# Altium project pressure_stm.PrjPcb
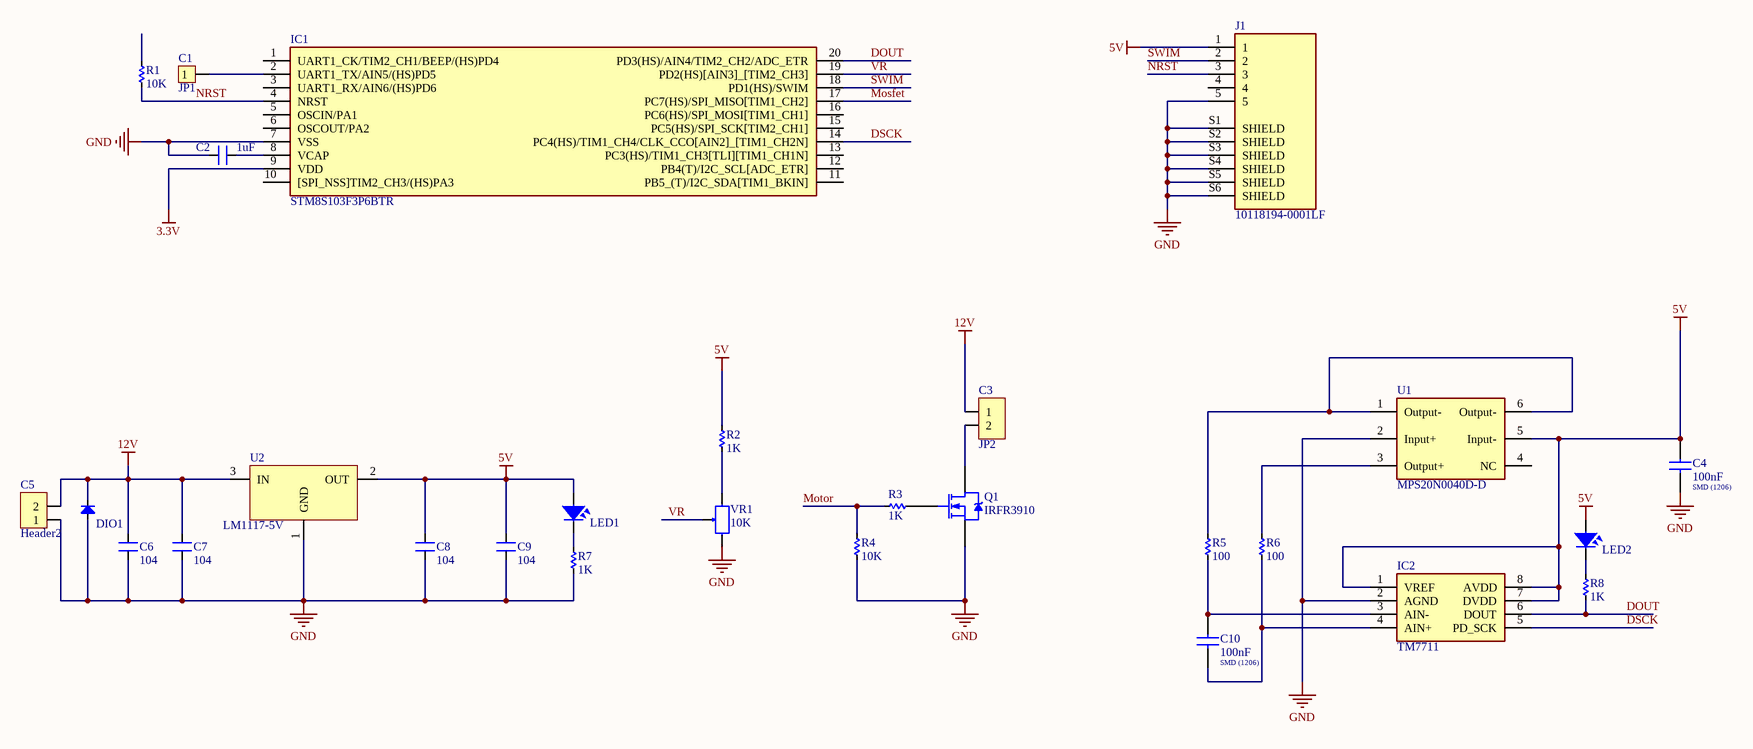
[diagram p0: pressure_stm_schematic.SchDoc]
1 sheet, 28 parts. Net scope: global (net labels, ports and power ports of the same name join across sheets).
Board file: pressure_stm_pcb.PcbDoc

## Sheet pressure_stm_schematic.SchDoc
size A3

### Parts
C1  JP1  [JP1-D1T]
C2  1uF  [CN-SMD-0805]
C3  JP2  [JP2-D1T]
C4  Valor: 100nF  Encapsulamento: SMD (1206)  [CAP_0603]  (hidden comment: Capacitor SMD)
C5  Header2  [Header2]
C6  104  [SM-CAP-0805]
C7  104  [SM-CAP-0805]
C8  104  [SM-CAP-0805]
C9  104  [SM-CAP-0805]
C10  Valor: 100nF  Encapsulamento: SMD (1206)  [CAP_0603]  (hidden comment: Capacitor SMD)
DIO1  Diode SMD  [DIO-SMD-106]  (value not drawn)
IC1  STM8S103F3P6BTR  [SOP65P640X120-20N]
IC2  TM7711  [SOIC127P600X196-8N]
J1  10118194-0001LF  [AMPHENOL_10118194-0001LF]
LED1  LED  [LED-0805-Blue]  (value not drawn)
LED2  LED  [LED-0805-Blue]  (value not drawn)
Q1  IRFR3910  [TO-252AA_N]
R1  10K  [RES-SMD-0805]
R2  1K  [RES-SMD-0603]
R3  1K  [RES-SMD-0603]
R4  10K  [RES-SMD-0603]
R5  100  [RES-SMD-0603]
R6  100  [RES-SMD-0603]
R7  1K  [RES-SMD-0603]
R8  1K  [RES-SMD-0603]
U1  MPS20N0040D-D  [XDCR_ADP5241]
U2  LM1117-5V  [SOT223]
VR1  10K  [VR]

### Nets
3.3V: IC1.9(VDD)
5V: C4.2 C8.2 C9.2 IC2.1(VREF) IC2.7(DVDD) IC2.8(AVDD) J1.1 LED1.1 LED2.1 R2.2 U1.5(Input-) U2.2(OUT)
12V: C3.1 C5.2 C6.2 C7.2 DIO1.2(K) U2.3(IN)
GND: C2.2 C4.1 C5.1 C6.1 C7.1 C8.1 C9.1 DIO1.1(A) IC1.7(VSS) IC2.2(AGND) J1.5 J1.S1(SHIELD) J1.S2(SHIELD) J1.S3(SHIELD) J1.S4(SHIELD) J1.S5(SHIELD) J1.S6(SHIELD) Q1.3(S) R4.2 R7.2 U1.2(Input+) U2.1(GND) VR1.1
DOUT: IC1.20(PD3(HS)/AIN4/TIM2_CH2/ADC_ETR) IC2.6(DOUT) R8.2
DSCK: IC1.14(PC4(HS)/TIM1_CH4/CLK_CCO[AIN2]_[TIM1_CH2N]) IC2.5(PD_SCK)
Mosfet: IC1.17(PC7(HS)/SPI_MISO[TIM1_CH2])
Motor: R3.1 R4.1
NRST: IC1.4(NRST) J1.3 R1.2
SWIM: IC1.18(PD1(HS)/SWIM) J1.2
VR: IC1.19(PD2(HS)[AIN3]_[TIM2_CH3]) VR1.2
NetC1_1: C1.1 IC1.2(UART1_TX/AIN5/(HS)PD5)
NetC2_1: C2.1 IC1.8(VCAP)
NetC3_2: C3.2 Q1.4(D)
NetC10_1: C10.1 IC2.4(AIN+) R6.2
NetC10_2: C10.2 IC2.3(AIN-) R5.2
NetLED1_2: LED1.2 R7.1
NetLED2_2: LED2.2 R8.1
NetQ1_1: Q1.1(G) R3.2
NetR2_1: R2.1 VR1.3
NetR5_1: R5.1 U1.1(Output-) U1.6(Output-)
NetR6_1: R6.1 U1.3(Output+)

Not connected (* = marked no-connect by the designer): IC1 1(UART1_CK/TIM2_CH1/BEEP/(HS)PD4) 3(UART1_RX/AIN6/(HS)PD6) 5(OSCIN/PA1) 6(OSCOUT/PA2) 10([SPI_NSS]TIM2_CH3/(HS)PA3) 11(PB5_(T)/I2C_SDA[TIM1_BKIN]) 12(PB4(T)/I2C_SCL[ADC_ETR]) 13(PC3(HS)/TIM1_CH3[TLI][TIM1_CH1N]) 15(PC5(HS)/SPI_SCK[TIM2_CH1]) 16(PC6(HS)/SPI_MOSI[TIM1_CH1]); J1 4; R1 1; U1 4(NC)

### Library data of the parts
C1 = JP1: WR-PHD 2.54 mm Angled Socket Header; Manufacturer: W¨¹rth Elektronik eiSos GmbH; partNo: 613002143121; ComponentLink1 Description: Manufacturer; ComponentLink2 Description: Datasheet; NoPins: 02; Created Date: 29 March 2013; ComponentLink1URL: http://www.we-online.com; ComponentLink2URL: http://katalog.we-online.de/em/datasheet/6130xx143121.pdf; Created by: Karrer Zheng
C2 = CN: Value: 33pF
C3 = JP2: WR-PHD 2.54 mm Angled Socket Header; Manufacturer: W¨¹rth Elektronik eiSos GmbH; partNo: 613002143121; ComponentLink1 Description: Manufacturer; ComponentLink2 Description: Datasheet; NoPins: 02; Created Date: 29 March 2013; ComponentLink1URL: http://www.we-online.com; ComponentLink2URL: http://katalog.we-online.de/em/datasheet/6130xx143121.pdf; Created by: Karrer Zheng
C5 = Header2: Header IDC, 2 x 1 Pin Vertical 2.54mm Pitch (Non-Boxed, Male); Manufacturer: W¨¹rth Elektronik eiSos GmbH; partNo: 613002143121; ComponentLink1 Description: Manufacturer; ComponentLink2 Description: Datasheet; NoPins: 02; Created Date: 29 March 2013; ComponentLink1URL: http://www.we-online.com; ComponentLink2URL: http://katalog.we-online.de/em/datasheet/6130xx143121.pdf; Created by: Karrer Zheng
C6-C9 = CN: Value: 0,1uF/300V; Designed by: VanDungEvn
DIO1 = Diode SMD: Default Diode; Code - JEDEC: DO-214-AB; Value: 1N5007; Published: 8-Jun-2000; Revision: July-2002: Re-released for DXP Platform.; Publisher: Altium Limited
IC1 = STM8S103F3P6BTR: Integrated Circuit; Manufacturer_Name: STMicroelectronics; Height: 1.2mm; Manufacturer_Part_Number: STM8S103F3P6BTR
IC2 = TM7711: Integrated Circuit; Manufacturer_Name: Shenzhen Titan Micro Elec; Datasheet Link: https://datasheet.lcsc.com/szlcsc/Shenzhen-Titan-Micro-Elec-TM7711_C80695.pdf; Height: 1.96mm; Manufacturer_Part_Number: TM7711
J1 = 10118194-0001LF: USB - micro B USB 2.0 Receptacle Connector 5 Position Surface Mount, Right Angle; Through Hole; MF: Amphenol ICC; Package: None; Price: None; Availability: Unavailable; MP: 10118194-0001LF; SnapEDA_Link: https://www.snapeda.com/parts/10118194-0001LF/Amphenol%20FCI/view-part/1413308/?ref=snap; Value: *
LED1 LED2 = LED SMD: Value: LED 3 - 5 ly 2 Colour
Q1 = IRFR3910: HEXFET Power MOSFET; Note: Pin 2 is trimmed and is electrically connected to Drain.; Published: 8-Jun-2000; LatestRevisionDate: 20-Nov-2009; LatestRevisionNote: IPC-7351 Footprint Added.; DatasheetVersion: May-1998; PackageVersion: Feb-2003; PackageReference: TO-252AA; Publisher: Altium Limited; PackageDescription: 3-Pin HEXFET Package 2.28 mm Pitch, 9.9 mm Lead Span; Code_JEDEC: TO-252-AA; ComponentLink1Description: Manufacturer Link; ComponentLink1URL: http://www.irf.com/; ComponentLink2Description: Datasheet; ComponentLink2URL: http://www.irf.com/product-info/datasheets/data/irfr3910.pdf
R1-R8 = Res-SMD: Resistor; Manufacturer: Generic Components; Class: Passive; Published: 08/06/2000; Publisher: Altium Hobart Technology Centre
U1 = MPS20N0040D-D: Pressure Sensor 14.5PSI (100kPa) Vented Gauge Male - 0.12 (3mm) Tube 0 V ~ 4.5 V 6-SMD Module; MP: ADP5241; MF: Panasonic; SnapEDA_Link: https://www.snapeda.com/parts/ADP5241/Panasonic/view-part/382466/?ref=snap; Availability: Bad; Purchase-URL: https://pricing.snapeda.com/search/part/ADP5241/?ref=eda; Check_prices: https://www.snapeda.com/parts/ADP5241/Panasonic/view-part/382466/?ref=eda; Price: None; Value: *; Package: SMD-6 Panasonic
U2 = LM1117: 800mA Low-Dropout Linear Regulator; Creator: Nguyen Ba Bien; Website: http://group3i.net
VR1 = VR: Var Resistor; Value: VR 10K
C4 C10 = Capacitor SMD: Descrição: Capacitor SMD; Marca: *; Modelo: *; Observação: *